# EAGLE design Tasmodul_RasPi_LoRa (EAGLE 9.6.2)
Assembly variants: STANDARD
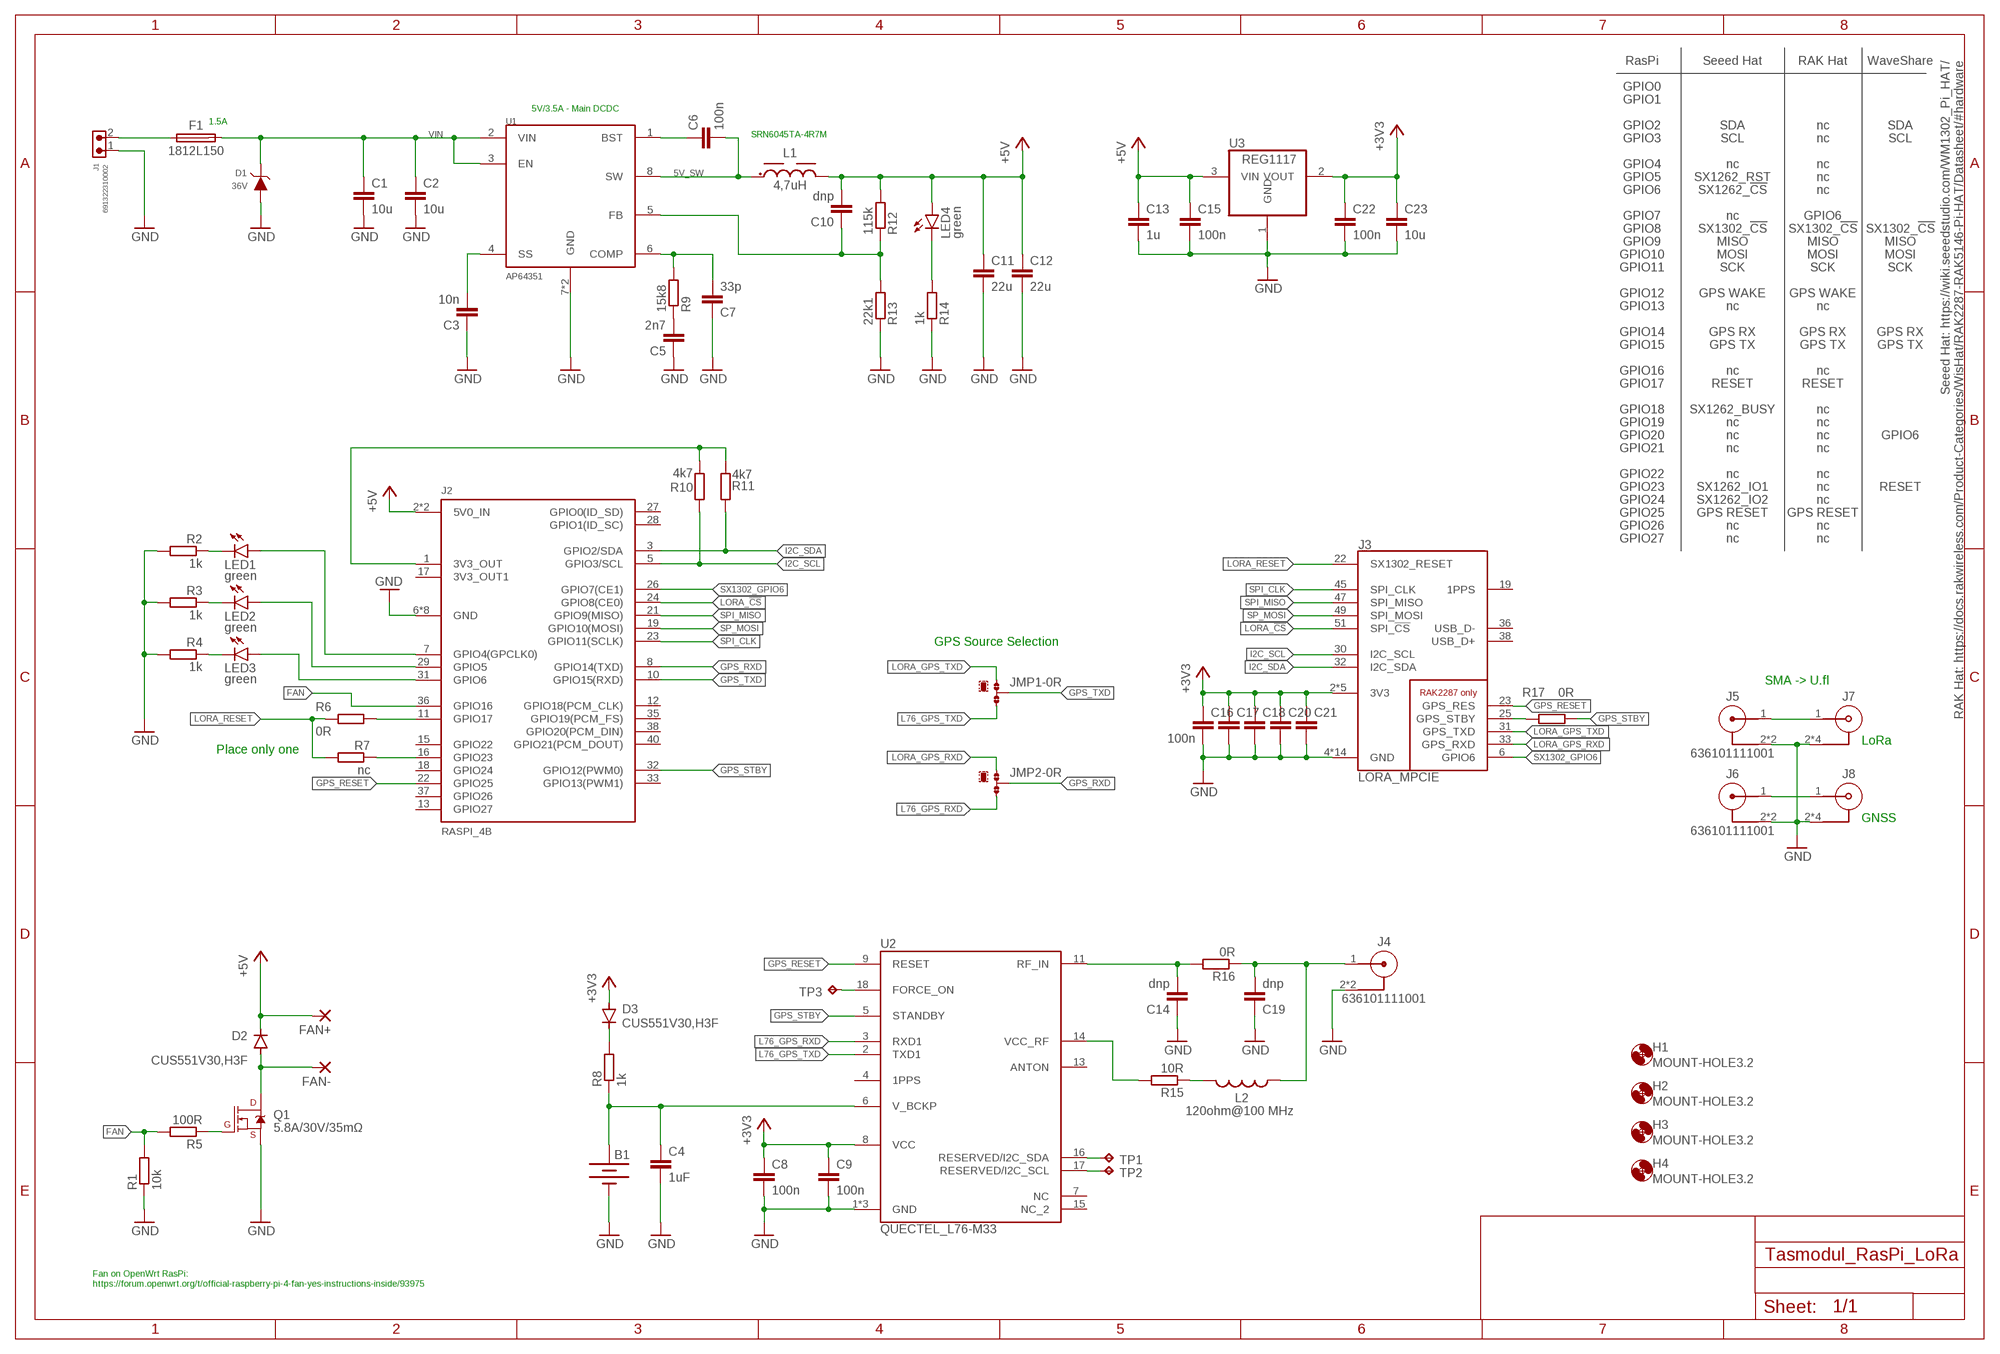
[diagram p0: schematic, sheet 1]

## Parts
B1  6.8MM_COIN_CELL  ML414H_IV01E_BATTERY  [ML414H_IV01E]
C1  10u  C-EUC1206  [C1206]
C2  10u  C-EUC1206  [C1206]
C3  10n  C-EUC0603  [C0603]
C4  1uF  C-EUC0603  [C0603]
C5  2n7  C-EUC0603  [C0603]
C6  100n  C-EUC0603  [C0603]
C7  33p  C-EUC0603  [C0603]
C8  100n  C-EUC0603  [C0603]
C9  100n  C-EUC0603  [C0603]
C10  dnp  C-EUC0603  [C0603]
C11  22u  C-EUC0805  [C0805]
C12  22u  C-EUC0805  [C0805]
C13  1u  C-EUC0603  [C0603]
C14  dnp  C-EUC0603  [C0603]  (not fitted in variant STANDARD)
C15  100n  C-EUC0603  [C0603]
C16  100n  C-EUC0603  [C0603]
C17  100n  C-EUC0603  [C0603]
C18  100n  C-EUC0603  [C0603]
C19  dnp  C-EUC0603  [C0603]  (not fitted in variant STANDARD)
C20  100n  C-EUC0603  [C0603]
C21  100n  C-EUC0603  [C0603]
C22  100n  C-EUC0603  [C0603]
C23  10u  C-EUC0603  [C0603]
D1  36V  WE-TVSP_DO-214AC_400W_UNI_824500361  [WE-TVSP_DO-214AC_UNIDIRECTIONAL]
D2  CUS551V30,H3F  DIODE-SOD323-R  [SOD323-R]
D3  CUS551V30,H3F  DIODE-SOD323-R  [SOD323-R]
F1  1812L150  [FUSC4532X125]
FAN+  1,6/0,8  [1,6/0,8]
FAN-  1,6/0,8  [1,6/0,8]
H1  MOUNT-HOLE3.2  [3,2]  (not fitted in variant STANDARD)
H2  MOUNT-HOLE3.2  [3,2]  (not fitted in variant STANDARD)
H3  MOUNT-HOLE3.2  [3,2]  (not fitted in variant STANDARD)
H4  MOUNT-HOLE3.2  [3,2]  (not fitted in variant STANDARD)
J1  691322310002  691322310002  [691322310002]
J2  RASPI_4B  [RASPI_4B_FLIPPED_SMD]
J3  LORA_MPCIE  [MINI_PCIE_CONNECTOR_5.2H]
J4  636101111001  [636101111001]
J5  636101111001  [636101111001]  (not fitted in variant STANDARD)
J6  636101111001  [636101111001]  (not fitted in variant STANDARD)
J7  60311002111526  [60311002111526]
J8  60311002111526  [60311002111526]
JMP1  0R-JUMPA  [A0R-JMP]
JMP2  0R-JUMPA  [A0R-JMP]
L1  4,7uH  WE-LQS_6045_74404064033  [WE-LQS_6045]
L2  120ohm@100 MHz  WE-CBF_0603_74279262_WB_HS  [WE-CBF_0603_W2.2]
LED1  green  LEDCHIPLED_0603  [CHIPLED_0603]
LED2  green  LEDCHIPLED_0603  [CHIPLED_0603]
LED3  green  LEDCHIPLED_0603  [CHIPLED_0603]
LED4  green  LEDCHIPLED_0603  [CHIPLED_0603]
Q1  5.8A/30V/35mΩ  MOSFET-NCH-AO3404A  [SOT23-3]
R1  10k  R-EU_R0603  [R0603]
R2  1k  R-EU_R0603  [R0603]
R3  1k  R-EU_R0603  [R0603]
R4  1k  R-EU_R0603  [R0603]
R5  100R  R-EU_R0603  [R0603]
R6  0R  R-EU_R0603  [R0603]
R7  nc  R-EU_R0603  [R0603]  (not fitted in variant STANDARD)
R8  1k  R-EU_R0603  [R0603]
R9  15k8  R-EU_R0603  [R0603]
R10  4k7  R-EU_R0603  [R0603]
R11  4k7  R-EU_R0603  [R0603]
R12  115k  R-EU_R0603  [R0603]
R13  22k1  R-EU_R0603  [R0603]
R14  1k  R-EU_R0603  [R0603]
R15  10R  R-EU_R0603  [R0603]
R16  0R  R-EU_R0603  [R0603]
R17  0R  R-EU_R0603  [R0603]
TP1  TPTP15R  [TP15R]  (not fitted in variant STANDARD)
TP2  TPTP15R  [TP15R]  (not fitted in variant STANDARD)
TP3  TPTP15R  [TP15R]  (not fitted in variant STANDARD)
U1  AP64351  [SOIC8-EP]
U2  QUECTEL_L76-M33  [L76_QWS]
U3  REG1117  [SOT223]

## Nets
5V_SW: C6.2 L1.1 U1.8(SW)
+3V3: C8.1 C9.1 C16.1 C17.1 C18.1 C20.1 C21.1 C22.1 C23.1 D3.A J3.2(3V3) J3.24(3V3) J3.39(3V3) J3.41(3V3) J3.52(3V3) U2.8(VCC) U3.2(VOUT)
+5V: C10.2 C11.1 C12.1 C13.1 C15.1 D2.C FAN+.1(P) J2.2(5V0_IN) J2.4(5V0_IN) L1.2 LED4.A R12.2 U3.3(VIN)
FAN: J2.36(GPIO16) R1.2 R5.2
GND: B1.- C1.2 C2.2 C3.1 C4.2 C5.1 C7.1 C8.2 C9.2 C11.2 C12.2 C13.2 C14.1 C15.2 C16.2 C17.2 C18.2 C19.1 C20.2 C21.2 C22.2 C23.2 D1.2(A) J1.1 J2.6(GND) J2.9(GND) J2.14(GND) J2.20(GND) J2.25(GND) J2.30(GND) J2.34(GND) J2.39(GND) J3.4(GND) J3.9(GND) J3.15(GND) J3.18(GND) J3.21(GND) J3.26(GND) J3.27(GND) J3.29(GND) J3.34(GND) J3.35(GND) J3.37(GND) J3.40(GND) J3.43(GND) J3.50(GND) J4.2 J4.3 J5.2 J5.3 J6.2 J6.3 J7.2 J7.3 J7.4 J7.5 J8.2 J8.3 J8.4 J8.5 Q1.2(S) R1.1 R2.2 R3.2 R4.2 R13.1 R14.1 U1.7(GND) U1.9(GND) U2.1(GND) U2.10(GND) U2.12(GND) U3.1(GND)
GPS_RESET: J2.22(GPIO25) J3.23(GPS_RES) U2.9(RESET)
GPS_RXD: J2.8(GPIO14(TXD)) JMP2.2
GPS_STBY: J2.32(GPIO12(PWM0)) R17.1 U2.5(STANDBY)
GPS_TXD: J2.10(GPIO15(RXD)) JMP1.2
HF_GNSS [50R]: J6.1 J8.1
HF_LORA [50R]: J5.1 J7.1
I2C_SCL: J2.5(GPIO3/SCL) J3.30(I2C_SCL) R10.1
I2C_SDA: J2.3(GPIO2/SDA) J3.32(I2C_SDA) R11.1
L76_GPS_RXD: JMP2.3 U2.3(RXD1)
L76_GPS_TXD: JMP1.3 U2.2(TXD1)
LORA_!CS: J2.24(GPIO8(CE0)) J3.51(SPI_!CS)
LORA_GPS_RXD: J3.33(GPS_RXD) JMP2.1
LORA_GPS_TXD: J3.31(GPS_TXD) JMP1.1
LORA_RESET: J3.22(SX1302_RESET) R6.2 R7.2
N$1: J2.16(GPIO23) R7.1
N$2: C3.2 U1.4(SS)
N$3: J2.11(GPIO17) R6.1
N$4: L2.2 R15.1
N$5: C6.1 U1.1(BST)
N$6: C10.1 R12.1 R13.2 U1.5(FB)
N$7: LED4.C R14.2
N$8: D3.C R8.2
N$9: Q1.1(G) R5.1
N$10: R15.2 U2.14(VCC_RF)
N$11: C5.2 R9.1
N$12: C7.2 R9.2 U1.6(COMP)
N$13: J2.1(3V3_OUT) R10.2 R11.2
N$14: D2.A FAN-.1(P) Q1.3(D)
N$15: F1.1 J1.2
N$16: TP1.TP U2.16(RESERVED/I2C_SDA)
N$17: TP2.TP U2.17(RESERVED/I2C_SCL)
N$18: TP3.TP U2.18(FORCE_ON)
N$19: J3.25(GPS_STBY) R17.2
N$20: LED1.C R2.1
N$21: LED2.C R3.1
N$22: LED3.C R4.1
N$23: J2.7(GPIO4(GPCLK0)) LED1.A
N$24: J2.29(GPIO5) LED2.A
N$25: J2.31(GPIO6) LED3.A
RF_CON [50R]: C19.2 J4.1 L2.1 R16.1
RF_MATCHED [50R]: C14.2 R16.2 U2.11(RF_IN)
SP_MOSI: J2.19(GPIO10(MOSI)) J3.49(SPI_MOSI)
SPI_CLK: J2.23(GPIO11(SCLK)) J3.45(SPI_CLK)
SPI_MISO: J2.21(GPIO9(MISO)) J3.47(SPI_MISO)
SX1302_GPIO6: J2.26(GPIO7(CE1)) J3.6(GPIO6)
VBAT: B1.+ C4.1 R8.1 U2.6(V_BCKP)
VIN: C1.1 C2.1 D1.1(C) F1.2 U1.2(VIN) U1.3(EN)
Unconnected: J2.12(GPIO18(PCM_CLK)) J2.13(GPIO27) J2.15(GPIO22) J2.17(3V3_OUT1) J2.18(GPIO24) J2.27(GPIO0(ID_SD)) J2.28(GPIO1(ID_SC)) J2.33(GPIO13(PWM1)) J2.35(GPIO19(PCM_FS)) J2.37(GPIO26) J2.38(GPIO20(PCM_DIN)) J2.40(GPIO21(PCM_DOUT)) J3.19(1PPS) J3.36(USB_D-) J3.38(USB_D+) U2.4(1PPS) U2.7(NC) U2.13(ANTON) U2.15(NC_2)

## Notes on the sheet
- RasPi | Seeed Hat | RAK Hat | WaveShare
- Seeed Hat: https://wiki.seeedstudio.com/WM1302_Pi_HAT/
  RAK Hat: https://docs.rakwireless.com/Product-Categories/WisHat/RAK2287-RAK5146-Pi-HAT/Datasheet/#hardware
- GPIO0
- GPIO1
- 5V/3.5A - Main DCDC
- 1.5A | GPIO2 | SDA | nc | SDA
- SRN6045TA-4R7M | GPIO3 | SCL | nc | SCL
- GPIO4 | nc | nc
- GPIO5 | SX1262_RST | nc
- GPIO6 | SX1262_!CS | nc
- GPIO7 | nc | GPIO6
- GPIO8 | SX1302_!CS | SX1302_!CS | SX1302_!CS
- GPIO9 | MISO | MISO | MISO
- GPIO10 | MOSI | MOSI | MOSI
- GPIO11 | SCK | SCK | SCK
- GPIO12 | GPS WAKE | GPS WAKE
- GPIO13 | nc | nc
- GPIO14 | GPS RX | GPS RX | GPS RX
- GPIO15 | GPS TX | GPS TX | GPS TX
- GPIO16 | nc | nc
- GPIO17 | RESET | RESET
- GPIO18 | SX1262_BUSY | nc
- GPIO19 | nc | nc
- GPIO20 | nc | nc | GPIO6
- GPIO21 | nc | nc
- GPIO22 | nc | nc
- GPIO23 | SX1262_IO1 | nc | RESET
- GPIO24 | SX1262_IO2 | nc
- GPIO25 | GPS RESET | GPS RESET
- GPIO26 | nc | nc
- GPIO27 | nc | nc
- GPS Source Selection
- SMA -> U.fl
- Place only one | LoRa
- GNSS
- Fan on OpenWrt RasPi:
  https://forum.openwrt.org/t/official-raspberry-pi-4-fan-yes-instructions-inside/93975

## Library data of the parts
B1 = SparkFun-Batteries:ML414H_IV01E_BATTERY: SEIKO ML414H-IV01E Reflowable Lithium Battery ML414H is a rechargeable, coin type battery with features such as Pb-free reflowable (Peak temperature: 260 C) and high temperature heat resistance. Battery Characteristics: 3.1V max voltage Voff is 2V 1mAH 3k series resistor with battery 72 hour charge time from 2.0-3.1V 2.3-2.8V initial charge; PROD_ID: BATT-14267
C1-C23 = rcl:C-EU: CAPACITOR, European symbol; SPICEPREFIX: C
D1 = Wurth_EMC Components_WE-TVSP:WE-TVSP_DO-214AC_400W_UNI: WE-TVSP Power TVS Diode Characteristics Low Profile Package Glass passivated Juction Excellent clamping capability Fast response time MSL Level 1, per J-STD-020 Classification of the plastic case: UL 94 V-0 Safety certification UL 497B, E478010 Identical design: - DO-214AC = SMAJ - DO-214AA = SMBJ - DO-214AB = SMCJ/SMDJ Applications Ideal to protect the I/O Interfaces, Bus Voltage and other circuits of sensetive electronic equipment against voltage transiensts <https://www.we-online.com/catalog/media/o55793v209%20WE-TVSP_600W-3000W_D0214AA_4C.jpg> Details see: https://www.we-online.com/catalog/en/WE-TVSP/ Updated by Ella Wu 2020-07-20 2020 (C) Würth Elektronik; DATASHEET-URL: https://www.we-online.com/catalog/datasheet/824500361.pdf; IPEAK: 6.9A; MOUNT: SMT; PART-NUMBER: 824500361; PDISS: 400W; VBR: 42.1V; VCLAMP: 58.1V
D2 D3 = diode:DIODE-: DIODE
F1 = Fuse:1812L: 1812L Series PTC provides surface mount overcurrent protection for applications where resettable protection is desired. Datasheet <https://www.littelfuse.com/~/media/electronics/datasheets/resettable_ptcs/littelfuse_ptc_1812l_datasheet.pdf.pdf>; CATEGORY: FUSE; DESCRIPTION: Resettable PTCs; MANUFACTURER: Littlefuse; MPN: 1812L150; OPERATING_TEMPERATURE: -40°C to +85°C; PART_STATUS: ACTIVE; ROHS_COMPLIANCE: RoHS Compliant; SERIES: 1812L; SUBCATEGORY: Resettable; TYPE: PTC
FAN+ FAN- = wirepad:1,6/0,8: THROUGH-HOLE PAD
H1-H4 = holes:MOUNT-HOLE: MOUNTING HOLE with drill center marker
J1 = Wurth_Connectors_WR-TBL Pluggable Connector:691322310002: WR-TBL Serie 322 - 3.81 mm Horizontal PCB Header KIND PROPERTIES Pitch 3.81 mm MATERIAL PROPERTIES Insulator Material PA66 Insulator Flammability Rating UL94 V-0 Contact Material Brass Contact Plating Tin GENERAL INFORMATION Operating Temperature -40 up to +105 °C Compliance RoHS ELECTRICAL PROPERTIES IR cULus 10 A IR VDE 10.5 A Working Voltage [cULus] 300 V (AC) Working Voltage [VDE] 300 V (AC) Withstanding Voltage [cULus] 1600 V (AC) Withstanding Voltage [VDE] 2500 V (AC) Contact Resistance [cULus] 20 mΩ Contact Resistance [VDE] 20 mΩ CERTIFICATION cULus Approval E315414 VDE Approval 40023195 <https://www.we-online.com/catalog/media/o33277v209%20Family_WR-TBL_6913223100xx.jpg> Details see: https://www.we-online.com/catalog/en/TBL_3_81_322_HORIZONTAL_PCB_HEADER_6913223100XX/ Updated by Ella Wu 2022-07-25 2022(C) Wurth Elektronik; DATASHEET-URL: https://www.we-online.com/redexpert/spec/691322310002?ae; IR-UL: 10A; IR-VDE: 10.5A; MOUNT: THT; PART-NUMBER: 691322310002; PINS: 2; PITCH: 3.81mm; TYPE: Horizontal; WORKING-VOLTAGE-UL: 300V (AC); WORKING-VOLTAGE-VDE: 300V (AC)
J2 = Eigene-Rietig:RASPI_4B
J3 = Eigene-Rietig:LORA_MPCIE: Seeed Studio WM1302 RAK Wireless RAK2287
J4-J6 = Wurth_Connectors_WR-UMRF:636101111001: WR-UMRF PCB Receptacle SMT with 3 Pads MATERIAL PROPERTIES Insulator Material LCP Insulator Color Natural Insulator Flammability Rating UL94 V-0 Center Contact Material Brass Center Contact Plating Gold over Nickel GENERAL INFORMATION Operating Temperature -40 up to +90 °C Electrical Properties f DC~6 GHz <https://www.we-online.com/components/media/o325314v209%20Single_WR-UMRF_63610111x001.jpg> Details see: www.we-online.com/components/products/PCB_RECECTACLE_SMT_WITH_3_PADS <www.we-online.com/catalog/PCB_RECECTACLE_SMT_WITH_3_PADS/?utm_source=eagle_model&utm_medium=description_link&utm_campaign=eisos_eagle> Updated by Ella Wu 2023-06-16 2023(C) Würth Elektronik; DATASHEET-URL: https://www.we-online.com/redexpert/spec/636101111001?ae; GENDER: PCB Receptacle; MOUNT: SMT; PART-NUMBER: 636101111001; Z: 50Ohm
J7 J8 = Wurth_Connectors_WR-SMA:60311002111526: WR-SMA PCB THT/THR/SMT Characteristics Interface: MIL-STD-348 Mating Cycle: 500 Cycles Impedance: 50Ω Insulation Resistance: 5000MΩ(min.) Withstanding Voltage: 1000Vrms(min.) Ingress Protection: None l IP67 Mating: Screw (Recommended by torque wrench tool) Applications Network and communications RF Test and measurement equipment Industrial applications Electronic consumers and device Outdoor or humidity environment <https://www.we-online.com/components/media/o176646v209%20Family-WR-SMA%20Cable%20Connectors.jpg> Details see: www.we-online.com/components/products/COAX_SMA_CONNECTOR_PCB_THT_THR_SMT <www.we-online.com/catalog/COAX_SMA_CONNECTOR_PCB_THT_THR_SMT/?utm_source=eagle_model&utm_medium=description_link&utm_campaign=eisos_eagle> Updated by Ella Wu 2023-10-10 2023(C) Würth Elektronik; DATASHEET-URL: https://www.we-online.com/redexpert/spec/60311002111526?ae; FREQUENCY-RANGE: DC~6 GHz; IMPEDANCE: 50Ohm; INTERFACE: MIL-STD-348; MOUNT: THT; PART-NUMBER: 60311002111526; SIZE: Right Angle Jack
JMP1 JMP2 = jump-0r-smd:0R-JUMP: SMD 0R 0805 Jumper
L1 = Wurth_Power Magnetics_WE-LQS:WE-LQS_6045: WE-LQS SMD Power Inductor Semi Shielded Characteristics Compact design Power Inductor 1.7 times more current than compared to an unshielded version Robust construction Low RDC Magnetically shielded by use of a magnetic resin Operating temperature: -40°C to +125°C Applications Integrated DC/DC Converters Switching controllers which require high efficiency Portable power (PDA, Smartphones, Digital Cameras, TVs, LCD etc.) Embedded Laptops and PCs Big sizes can be used in shock resisting circuits <https://www.we-online.com/catalog/media/o14807v209%20Family_WE-LQS.jpg> Details see: www.we-online.com/catalog/WE-LQS <www.we-online.com/catalog/WE-LQS/?utm_source=eagle_model&utm_medium=description_link&utm_campaign=eisos_eagle> Updated by Ella Wu 2022-07-21 2022 (C) Wurth Elektronik; DATASHEET-URL: https://www.we-online.com/redexpert/spec/74404064033?ae; FRES: 42MHz; IR: 4.2A; ISAT: 6.5A; PART-NUMBER: 74404064033; RDC: 21mOhm; VALUE: 3.3uH
L2 = Wurth_EMC Components_WE-CBF:WE-CBF_0603: WE-CBF SMD EMI Suppression Ferrite Bead Characteristics Reliable Ni-Sn electrodes High rated current up to 10 A AEC-Q200 qualified Operating temperature: –55 ºC to +125 ºC Applications Perfect as data line filter and for uncoupling of distribution voltage <https://www.we-online.com/components/media/o14753v209%20Family_WE-CBF.jpg> Details see: www.we-online.com/en/components/products/WE-CBF <www.we-online.com/catalog/WE-CBF/?utm_source=eagle_model&utm_medium=description_link&utm_campaign=eisos_eagle> Updated by Ella Wu 2024-01-29 2024(C) Wurth Elektronik; DATASHEET-URL: https://www.we-online.com/redexpert/spec/74279262?ae; FI: 0.3mm; HEIGHT: 0.8mm; IR2: 1350mA; LENGTH: 1.6mm; MOUNT: SMT; PART-NUMBER: 74279262; RDC-MAX: 0.3ohm; SIZE: 0603; TYPE: Wide Band; WIDTH: 0.8mm; Z-MAX: 200ohm@510 MHz
LED1-LED4 = led:LED: LED OSRAM: - CHIPLED LG R971, LG N971, LY N971, LG Q971, LY Q971, LO R971, LY R971 LH N974, LH R974 LS Q976, LO Q976, LY Q976 LO Q996 - Hyper CHIPLED LW Q18S LB Q993, LB Q99A, LB R99A - SideLED LS A670, LO A670, LY A670, LG A670, LP A670 LB A673, LV A673, LT A673, LW A673 LH A674 LY A675 LS A676, LA A676, LO A676, LY A676, LW A676 LS A679, LY A679, LG A679 - Hyper Micro SIDELED® LS Y876, LA Y876, LO Y876, LY Y876 LT Y87S - SmartLED LW L88C, LW L88S LB L89C, LB L89S, LG L890 LS L89K, LO L89K, LY L89K LS L896, LA L896, LO L896, LY L896 - TOPLED LS T670, LO T670, LY T670, LG T670, LP T670 LSG T670, LSP T670, LSY T670, LOP T670, LYG T670 LG T671, LOG T671, LSG T671 LB T673, LV T673, LT T673, LW T673 LH T674 LS T676, LA T676, LO T676, LY T676, LB T676, LH T676, LSB T676, LW T676 LB T67C, LV T67C, LT T67C, LS T67K, LO T67K, LY T67K, LW E67C LS E67B, LA E67B, LO E67B, LY E67B, LB E67C, LV E67C, LT E67C LW T67C LS T679, LY T679, LG T679 LS T770, LO T770, LY T770, LG T770, LP T770 LB T773, LV T773, LT T773, LW T773 LH T774 LS E675, LA E675, LY E675, LS T675 LS T776, LA T776, LO T776, LY T776, LB T776 LHGB T686 LT T68C, LB T68C - Hyper Mini TOPLED® LB M676 - Mini TOPLED Santana® LG M470 LS M47K, LO M47K, LY M47K Source: http://www.osram.convergy.de LUXEON: - LUMILED® LXK2-PW12-R00, LXK2-PW12-S00, LXK2-PW14-U00, LXK2-PW14-V00 LXK2-PM12-R00, LXK2-PM12-S00, LXK2-PM14-U00 LXK2-PE12-Q00, LXK2-PE12-R00, LXK2-PE12-S00, LXK2-PE14-T00, LXK2-PE14-U00 LXK2-PB12-K00, LXK2-PB12-L00, LXK2-PB12-M00, LXK2-PB14-N00, LXK2-PB14-P00, LXK2-PB14-Q00 LXK2-PR12-L00, LXK2-PR12-M00, LXK2-PR14-Q00, LXK2-PR14-R00 LXK2-PD12-Q00, LXK2-PD12-R00, LXK2-PD12-S00 LXK2-PH12-R00, LXK2-PH12-S00 LXK2-PL12-P00, LXK2-PL12-Q00, LXK2-PL12-R00 Source: www.luxeon.com KINGBRIGHT: KA-3528ASYC Source: www.kingbright.com
Q1 = SparkFun-DiscreteSemi:MOSFET-NCH: N-channel MOSFETs Voltage controlled devices that allow control of high current outputs. SparkFun Products: SparkFun OpenScale <https://www.sparkfun.com/products/13261> SparkFun Digital Sandbox <https://www.sparkfun.com/products/12651> SparkFun Monster Moto Shield <https://www.sparkfun.com/products/10182> SparkFun MOSFET Power Controller <https://www.sparkfun.com/products/11214>; PROD_ID: TRANS-12988
R1-R17 = rcl:R-EU_: RESISTOR, European symbol; SPICEPREFIX: R
TP1-TP3 = testpad:TP: Test pad
U1 = Eigene-Rietig:AP64351
U2 = Eigene-Rietig:QUECTEL_L76-M33
U3 = burr-brown:REG1117: 800mA and 1A Low Dropout (LDO) Positive Regulator 1.8V, 2.5V, 2.85V, 3.3V, 5V, and Adj; MPN: REG1117

## Net classes
1 50R: clearance 0.5 mm

## Board
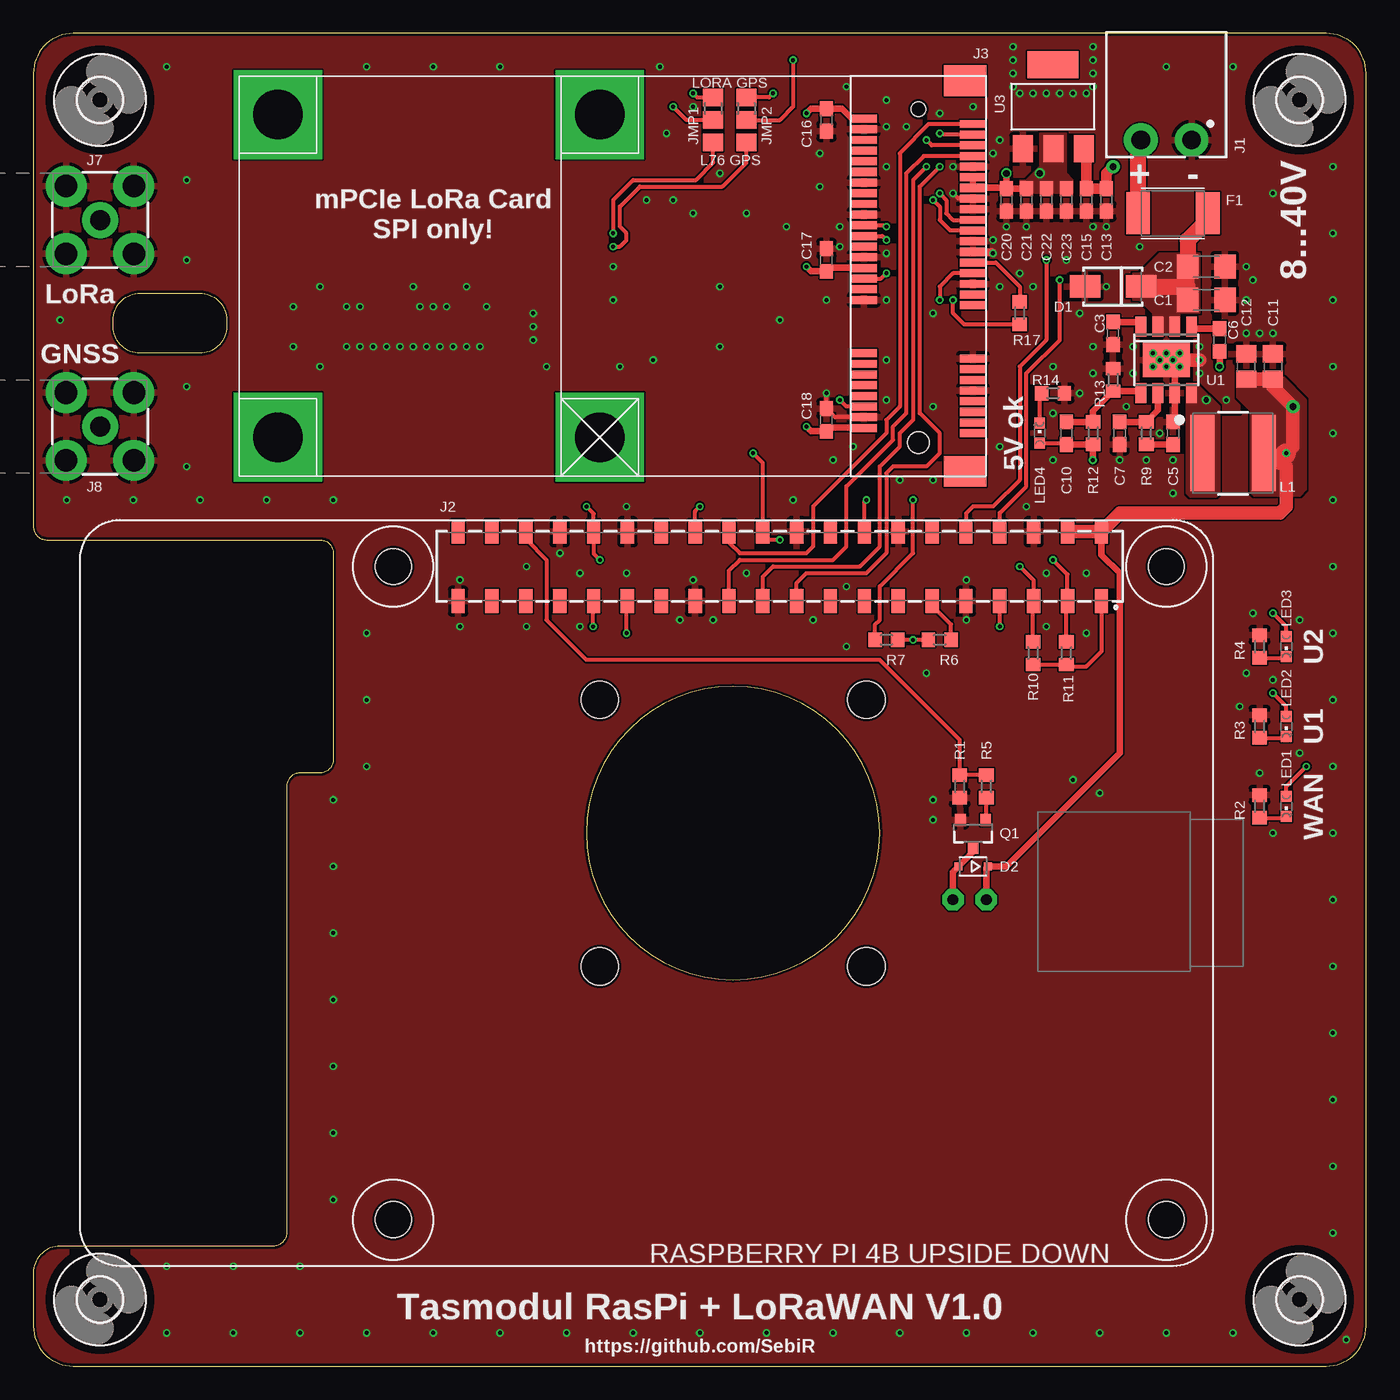
[diagram p1: board, top side]
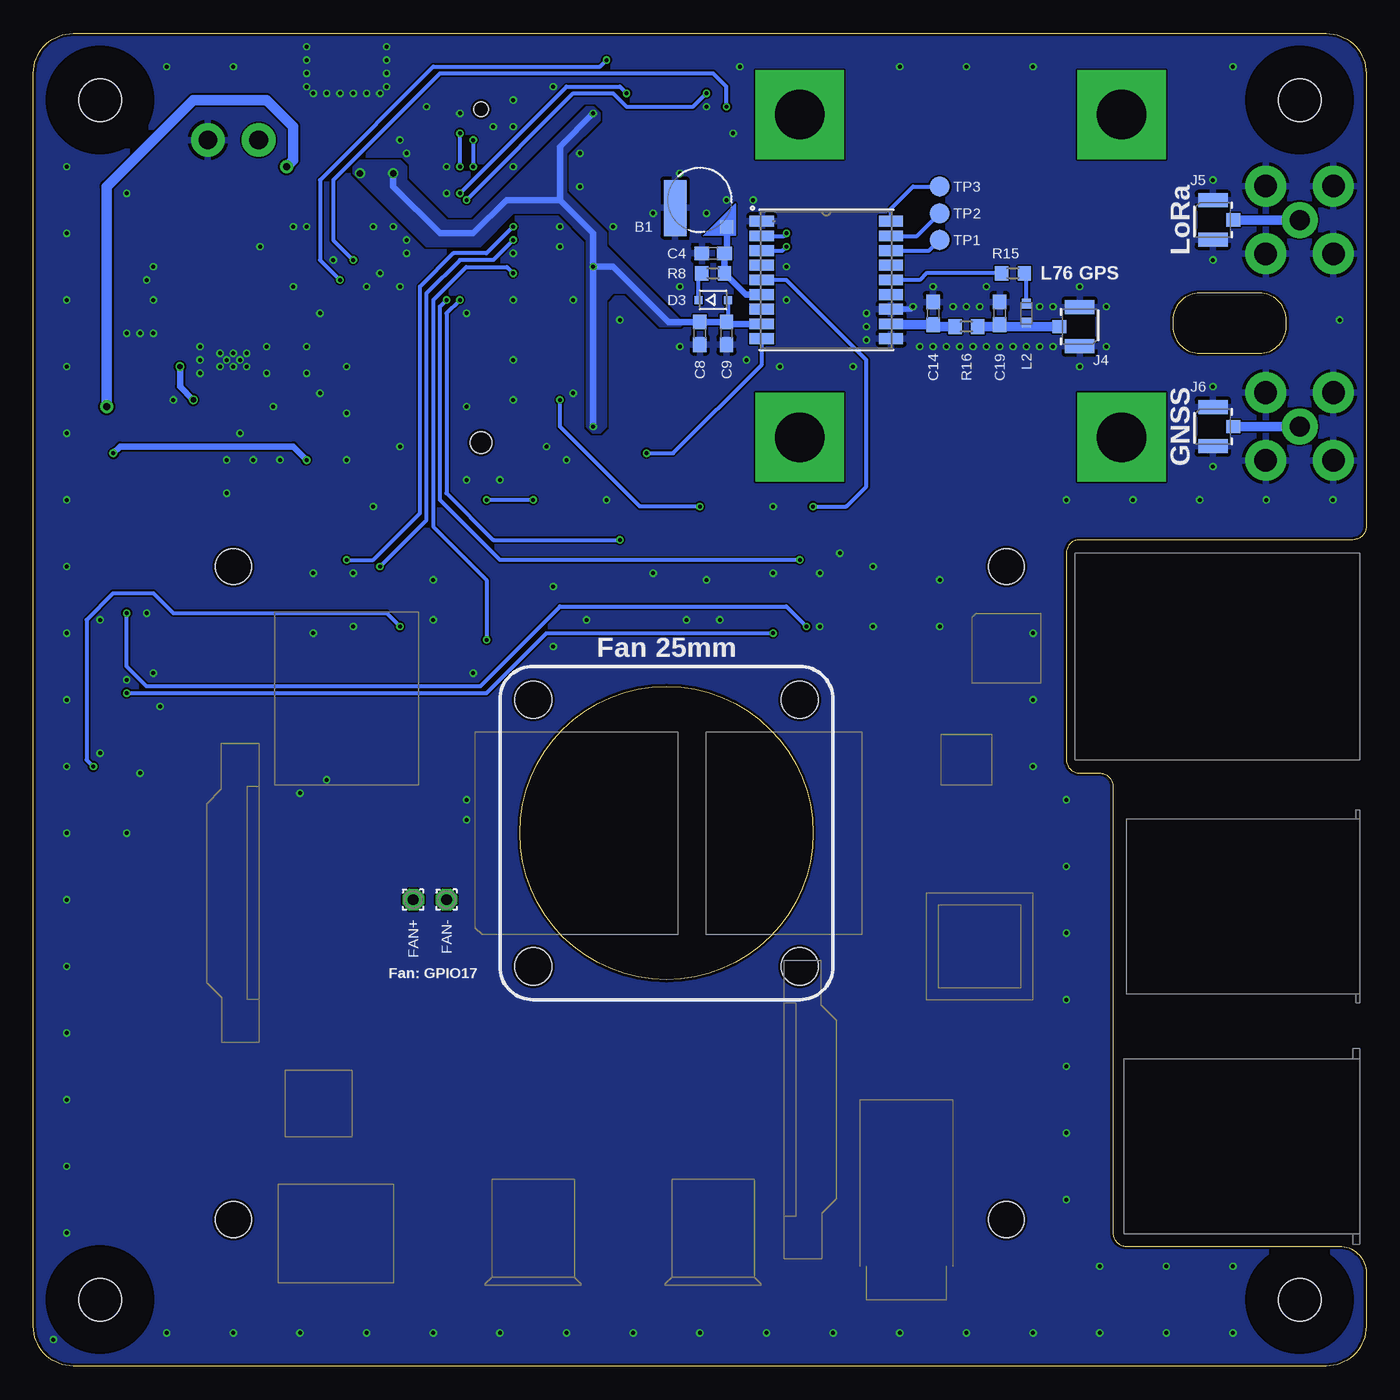
[diagram p2: board, bottom side, seen from below]

Size 100 x 100 mm. Coordinates in mm from the lower left corner, seen from the top.
Outline: 0,97 0,63 arc90 1,62 21.5,62 arc-90 22.5,61 22.5,45.5 arc-90 21.5,44.5 20,44.5 arc90 19,43.5 19,10 arc-90 18,9 2,9 arc90 0,7 0,3 arc90 3,0 97,0 arc90 100,3 100,97 arc90 97,100 3,100 arc90 0,97
Outline: 12.5,76 8,76 arc-90 6,78 6,78.5 arc-90 8,80.5 12.5,80.5 arc-90 14.5,78.5 14.5,78 arc-90 12.5,76
Copper layers (1*16): Top 0.035mm / dielectric 1.6mm / Bottom 0.035mm
Design rules "jlcpcb-2layers": minimum track width 0.2mm, minimum drill 0.3mm, track to track 5mil, track to pad 5mil, pad to pad 5mil, via to via 5mil, smd to smd 5mil, copper to edge 0.2mm, drill to drill 6mil, minimum pad ring 10mil, minimum via ring 0.125mm, stop-mask expansion 4mil, vias tented up to drill 0.5mm, thermal gap 10mil
tRestrict: 1 lines

### Footprints (pad centres in the part's own frame; a part is rotated, then mirrored left to right if it is on the bottom)
ML414H_IV01E = smd 1 x 1: + 2.022,2.032 | smd 4.2 x 1.7: - 0.6,-1.85
C1206 = smd 1.6 x 1.8: 1 -1.4,0; 2 1.4,0
C0603 = smd 1.1 x 1: 1 -0.85,0; 2 0.85,0
C0805 = smd 1.3 x 1.5: 1 -0.95,0; 2 0.95,0
WE-TVSP_DO-214AC_UNIDIRECTIONAL = smd 2.3 x 1.7: 1 -2.1,0; 2 2.1,0
SOD323-R = smd 0.6 x 0.6: A 1.1,0; C -1.1,0
FUSC4532X125 = smd 1.78 x 3.15: 1 -2.615,0; 2 2.615,0
1,6/0,8 = drill 0.813 pad 1.6 octagon: 1 0,0
3,2 = hole 3.2: 0,0
691322310002 = drill 1.4: 1 -1.905,0; 2 1.905,0
RASPI_4B_FLIPPED_SMD = smd 1 x 1.8: 1 76.632,49.902; 2 76.632,55.102; 3 74.092,49.902; 4 74.092,55.102; 5 71.552,49.902; 6 71.552,55.102; 7 69.012,49.902; 8 69.012,55.102; 9 66.472,49.902; 10 66.472,55.102; 11 63.932,49.902; 12 63.932,55.102; 13 61.392,49.902; 14 61.392,55.102; 15 58.852,49.902; 16 58.852,55.102; 17 56.312,49.902; 18 56.312,55.102; 19 53.772,49.902; 20 53.772,55.102; 21 51.232,49.902; 22 51.232,55.102; 23 48.692,49.902; 24 48.692,55.102; 25 46.152,49.902; 26 46.152,55.102; 27 43.612,49.902; 28 43.612,55.102; 29 41.072,49.902; 30 41.072,55.102; 31 38.532,49.902; 32 38.532,55.102; 33 35.992,49.902; 34 35.992,55.102; 35 33.452,49.902; 36 33.452,55.102; 37 30.912,49.902; 38 30.912,55.102; 39 28.372,49.902; 40 28.372,55.102 | hole 2.7: 81.5,52.5; 23.5,52.5; 23.5,3.5; 81.5,3.5
MINI_PCIE_CONNECTOR_5.2H = smd 0.6 x 2: 1 0,0; 2 0.4,8.2; 3 0.8,0; 4 1.2,8.2; 5 1.6,0; 6 2,8.2; 7 2.4,0; 8 2.8,8.2; 9 3.2,0; 10 3.6,8.2; 11 4,0; 12 4.4,8.2; 13 4.8,-0.005; 14 5.2,8.2; 15 5.6,0; 16 6,8.2; 17 9.6,0; 18 10,8.2; 19 10.4,0; 20 10.8,8.2; 21 11.2,0; 22 11.6,8.2; 23 12,-0.005; 24 12.4,8.2; 25 12.8,0; 26 13.2,8.2; 27 13.6,0; 28 14,8.2; 29 14.4,0; 30 14.8,8.2; 31 15.2,0; 32 15.6,8.2; 33 16,0; 34 16.4,8.2; 35 16.8,0; 36 17.2,8.2; 37 17.6,0; 38 18,8.2; 39 18.4,0; 40 18.8,8.2; 41 19.2,0; 42 19.6,8.2; 43 20,0; 44 20.4,8.2; 45 20.8,0; 46 21.2,8.2; 47 21.6,0; 48 22,8.2; 49 22.4,0; 50 22.8,8.2; 51 23.2,0; 52 23.6,8.2 | smd 2.3 x 3.2: 53 26.45,0.6; 55 -2.85,0.6 | drill 3.7 pad 5.8 square: M1 -0.3,28; M2 23.9,28; M3 -0.3,52.15; M4 23.9,52.15 | hole 1.6: -0.7,4.1 | hole 1.1: 24.3,4.1
636101111001 = smd 1 x 1.05: 1 0,-1.525 | smd 1.05 x 2.2: 2 1.475,0; 3 -1.475,0
60311002111526 = drill 1.5: 1 0,0 | drill 1.7: 2 -2.54,2.54; 3 2.54,2.54; 4 2.54,-2.54; 5 -2.54,-2.54
A0R-JMP = smd 1.5 x 1.3: 1 0,1.7; 2 0,0; 3 0,-1.7
WE-LQS_6045 = smd 1.8 x 5.7: 1 2.3,0; 2 -2.3,0
WE-CBF_0603_W2.2 = smd 0.75 x 0.7: 1 -0.725,0; 2 0.725,0
CHIPLED_0603 = smd 0.8 x 0.8: A 0,-0.75; C 0,0.75
SOT23-3 = smd 0.8 x 0.9: 1 -0.95,-1; 2 0.95,-1; 3 0,1.1
R0603 = smd 1 x 1.1: 1 -0.85,0; 2 0.85,0
TP15R = smd 1.5 x 1.5: TP 0,0
SOIC8-EP = smd 0.8 x 1.5: 1 -1.905,-2.5; 2 -0.635,-2.5; 3 0.635,-2.5; 4 1.905,-2.5; 5 1.905,2.5; 6 0.635,2.5; 7 -0.635,2.5; 8 -1.905,2.5 | smd 3.502 x 2.613: 9 0,0
L76_QWS = smd 1.803 x 0.813: 1 -4.85,4.4; 2 -4.85,3.3; 3 -4.85,2.2; 4 -4.85,1.1; 5 -4.85,0; 6 -4.85,-1.1; 7 -4.85,-2.2; 8 -4.85,-3.3; 9 -4.85,-4.4; 10 4.85,-4.4; 11 4.85,-3.3; 12 4.85,-2.2; 13 4.85,-1.1; 14 4.85,0; 15 4.85,1.1; 16 4.85,2.2; 17 4.85,3.3; 18 4.85,4.4
SOT223 = smd 1.499 x 2.007: 1 -2.261,-3.15; 2 0.025,-3.15; 3 2.311,-3.15 | smd 3.81 x 2.007: 4 0,3.15
FAN_25MM = hole 2.8: -10,10; 10,10; 10,-10; -10,-10

### Placement (x,y rotation side)
B1  50,87.5 270 bottom
C1  88,80 0 top
C2  88,82.5 0 top
C3  81,77.5 90 top
C4  49,83.5 180 bottom
C5  85.5,70 270 top
C6  89,77 270 top
C7  81.5,70 90 top
C8  50,77.5 270 bottom
C9  48,77.5 270 bottom
C10  77.5,70 270 top
C11  93,75 90 top
C12  91,75 90 top
C13  80.5,87.5 270 top
C14  32.5,79 270 bottom
C15  79,87.5 270 top
C16  59.5,93.5 270 top
C17  59.5,83 90 top
C18  59.5,71 90 top
C19  27.5,79 270 bottom
C20  73,87.5 270 top
C21  74.5,87.5 270 top
C22  76,87.5 270 top
C23  77.5,87.5 270 top
D1  81,81 180 top
D2  70.5,37.5 180 top
D3  49,80 0 bottom
F1  85.5,86.5 0 top
FAN+  71.5,35 0 bottom
FAN-  69,35 0 bottom
H1  5,5 0 top
H2  95,5 0 top
H3  95,95 0 top
H4  5,95 0 top
J1  85,92 180 top
J2  3.5,7.5 0 top
J3  70.5,70 90 top
J4  21.5,78 270 bottom
J5  11.5,86 90 bottom
J6  11.5,70.5 90 bottom
J7  5,86 180 top
J8  5,70.5 180 top
JMP1  51,93.5 0 top
JMP2  53.5,93.5 0 top
L1  90,68.5 180 top
L2  25.5,79 90 bottom
LED1  94,42 180 top
LED2  94,48 180 top
LED3  94,54 180 top
LED4  75.5,70 0 top
Q1  70.5,40 180 top
R1  69.5,43.5 90 top
R2  92,42 90 top
R3  92,48 90 top
R4  92,54 90 top
R5  71.5,43.5 90 top
R6  68,54.5 180 top
R7  64,54.5 0 top
R8  49,82 180 bottom
R9  83.5,70 90 top
R10  75,53.5 270 top
R11  77.5,53.5 270 top
R12  79.5,70 270 top
R13  81,74 270 top
R14  76.5,73 180 top
R15  26.5,82 180 bottom
R16  30,78 180 bottom
R17  74,79 90 top
TP1  32,84.5 0 bottom
TP2  32,86.5 0 bottom
TP3  32,88.5 0 bottom
U1  85,75.5 180 top
U2  40.5,81.5 0 bottom
U3  76.5,94.5 0 top
U$1  [FAN_25MM]  52.5,40 0 bottom

### Tracks (layer width: path | path; a pad name or v marks a point on that pad's centre or on a via)
5V_SW  (via drill 0.4)
  Top 0.5: C6.2 v89,75
  Bottom 0.5: v89,75 89,73.5 v88,72.5
  pour Top (no thermals): 86.5,73.7 86.5,65.5 86.8,65.2 88.7,65.2 89,65.5 89,72 87.3,73.7
+3V3  (via drill 0.3, 0.5)
  Top 0.5: v58,94 58.35,94.35 C16.1 60.65,94.35 61.4,93.6 J3.52 | v58,82.5 58.35,82.15 C17.1 59.75,82.4 J3.24 | v58,70.5 58.35,70.15 C18.1 59.75,70.4 J3.2 | C20.1 72.95,88.4 J3.39 J3.41 | C20.1 C21.1 | v73,89.5 C20.1
  Bottom 0.3: D3.A 47.9,78.45 C9.1
  Bottom 0.5: v58,94 60.5,91.5 60.5,87.5 | v58,82.5 58,85 60.5,87.5 | 60.5,87.5 64.5,87.5 67,85 69.5,85 73,88.5 v73,89.5 | v58,70.5 v58,82.5 | U2.8 47.85,78.2 C9.1 C8.1 52.35,78.35 56.5,82.5 v58,82.5
  other vias: 75.5,89.5
  pour Top (no thermals): 75.5,92.5 77.5,92.5 77.5,89.5 78,89 78,88 74,88 74,89 74.5,89 75.5,90
  pour Bottom: 72.5,90.5 75.5,90.5 76,90 76,89.5 70.5,84 66.5,84 64,86.5 60.5,86.5 58.5,84.5 58.5,70.5 58,70 57.5,70 57,70.5 57,76.5 57,76.5 57,80 56.5,80.5 55.5,80.5 53,78 51.5,78 51.25,78.25 57,84 57,85 60,88 60,91 57.5,93.5 57.5,94 58,94.5 58.5,94.5 67,86 69,86 72,89 72,90
+5V  (via drill 0.3 pad 0.6, 0.5 pad 1)
  Top 0.3: LED4.A 77.4,69.25 C10.2
  Top 0.5: v94,68.5 L1.2 | C10.2 R12.2 v79.5,68 | FAN+.1 71.5,37.4 D2.C 73,37.5 81.5,46 81.5,59.5 80.13,60.87 J2.2
  Top 0.8: U3.3 79,91.16 C15.1 C13.1 80.5,89.5 v81,90
  Top 1: J2.4 J2.2 81.53,64 93.5,64 94,64.5 94,67.5 93.5,68 | v94,68.5 94.5,69 v94.5,72 93,73.5 C11.1 C12.1
  Top 1.5: 93.5,68 v94,68.5
  Bottom 0.5: v79.5,68 80.5,69 93.5,69 v94,68.5
  Bottom 0.8: v81,90 80.5,90.5 80.5,93 82.5,95 88,95 94.5,88.5 v94.5,72
  pour Top (no thermals): 90.3,74.2 90.3,72.7 91.3,71.7 91.3,65.6 91.6,65.3 95,65.3 95.5,65.8 95.5,72.5 93.8,74.2
FAN
  Top 0.3: R5.2 R1.2 69.5,47 63.5,53 41.5,53 38.5,56 38.5,60.5 36.95,62.05 J2.36
GND  (via drill 0.3)
  Top 0.3: v59.5,73 C18.2 60.15,71.2 J3.4 | J3.37 69.4,87.6 v69,88
  Top 0.5: C5.1 85.64,70.98 U1.7 85.64,74.64 v86,75
  Top 0.6: J3.27 71.9,83.6 v72,83.5
  Top 1: U1.9 v87.5,75.5
  Bottom 0.4: U2.12 34.2,79.3 v34,79.5
  other vias: 86,76 84,76 84,75 85,75 85,76 82.5,76.5 82.5,74.5 82,72 85.5,75.5 84.5,75.5 91,82.5 91,80 93,77.5 91,77.5 87.5,76.5 87.5,74.5 84.5,70 81.5,68 83.5,68 85.5,68 79.5,76.5 79.5,74.5 78.5,79 77.5,83 80.5,81 74,95.5 75,95.5 76,95.5 77,95.5 78,95.5 79,95.5 79.5,96 79.5,97 79.5,98 79.5,99 73.5,96 73.5,97 73.5,98 73.5,99 69,90 64,90 64,95 64,83.5 64,80 74,82 72,84.5 64,93 59,91 60.5,84 73,85.5 74.5,85.5 72.5,81 32.5,81 28.5,81 29,79.5 30,79.5 31,79.5 24.5,79.5 23.5,79.5 21.5,81 19.5,79.5 19.5,76.5 21.5,75 23.5,76.5 24.5,76.5 25.5,76.5 26.5,76.5 27.5,76.5 28.5,76.5 29.5,76.5 30.5,76.5 31.5,76.5 32.5,76.5 33.5,76.5 37.5,77 37.5,78 37.5,79 72,91 44.5,64.5 49.5,59 70,59 39.5,61 32,59 48,87.5 53.5,86.5 49.5,86.5 70,56 58.5,56 10,2.5 98.5,2 15,2.5 20,2.5 25,2.5 30,2.5 35,2.5 40,2.5 45,2.5 50,2.5 55,2.5 60,2.5 65,2.5 70,2.5 75,2.5 80,2.5 85,2.5 90,2.5 97.5,10 97.5,15 97.5,20 97.5,25 97.5,30 97.5,35 97.5,40 97.5,45 97.5,50 97.5,55 97.5,60 97.5,65 97.5,70 97.5,75 97.5,80 97.5,85 97.5,90 90,97.5 85,97.5 10,97.5 25,97.5 30,97.5 35,97.5 47.5,92.5 10,7.5 15,7.5 20,7.5 22.5,12.5 22.5,17.5 22.5,22.5 22.5,27.5 22.5,32.5 22.5,37.5 22.5,42.5 25,45 25,50 25,55 2.5,65 7.5,65 12.5,65 17.5,65 22.5,65 57,65 60,68 61.5,69 65,66.5 67.5,66.5 61,58.5 11.5,73.5 11.5,67.5 11.5,89 11.5,83 2,78.5 68,94 65.5,93 67.5,72 72.5,69 75,81 64,72.5 56,78.5 56.5,85.5 60.5,85.5 49.5,94.5 61,96 51.5,89.5 43.5,80 38.5,75 44,75 46.5,75.5 51.5,76.5 51.5,81 59.5,80 41,55.5 37,60 53.5,59.5 74.5,64.5 85.5,65.5 89.5,72.5 92,77.5 91.5,81.5 83,84 93,88 76.5,68 76.5,71.5 76.5,75 64,75.5 67.5,79 61,54 41,59.5 67,52 76,55.5 78,44 80,43 67.5,42.5 67.5,41 92,44.5 91,52 93,51.5 90.5,49.5 91.5,56.5 95,56 95,46 93,40 48.5,56 51,56 37,55.5 46,87.5 43.5,82.5 79.5,85.5 80.5,85.5 47,97.5 78.5,73 32,55.5 44.5,59.5 59,88.5 79,55 79,59.5 76,59.5 72.5,92 70.5,94.5
  pour Top (rank 6): 0,100 100,100 100,0 0,0
  pour Bottom (rank 6): 0,100 100,100 100,0 0,0
GPS_RESET  (via drill 0.3)
  Top 0.3: v56,62 55,62 54.73,62.27 J2.22 54.73,67.77 v54,68.5 | J3.23 69,82 68,81 v68,80
  Bottom 0.3: v68,80 69,79 69,65.5 65.5,62 v56,62 | v54,68.5 52,68.5 45.35,75.15 U2.9
GPS_RXD  (via drill 0.3)
  Top 0.3: JMP2.2 56,93.5 57,94.5 v57,98 | J2.8 72.51,64.01 74.5,66 74.5,74.5 77,77 v77,81.5
  Bottom 0.3: v77,81.5 78.5,83 78.5,89 70,97.5 57.5,97.5 v57,98
GPS_STBY  (via drill 0.3)
  Top 0.3: v42.5,60.5 42.03,60.97 J2.32 42.03,63.97 v41.5,64.5 | R17.1 69.85,78.15 69,79 v69,80
  Bottom 0.3: v42.5,60.5 65,60.5 69.5,65 69.5,79.5 v69,80 | v41.5,64.5 39,64.5 37.5,66 37.5,75.5 43.5,81.5 U2.5
GPS_TXD  (via drill 0.3)
  Top 0.3: v76,83 76,77 74,75 74,66.5 72,64.5 70.5,64.5 69.97,63.97 J2.10 | JMP1.2 49,93.5 v48,94.5
  Bottom 0.3: v76,83 77.5,84.5 77.5,89 69.5,97 49,97 48,96 v48,94.5
HF_GNSS
  Bottom 0.7: J8.1 J6.1
HF_LORA
  Bottom 0.7: J7.1 J5.1
I2C_SCL  (via drill 0.3)
  Top 0.3: J3.30 63.7,84.8 v64,84.5 | J2.5 75.05,57.5 | 75.05,57.5 75.05,58.95 v74,60 | R10.1 75,57.45 75.05,57.5
  Bottom 0.3: v64,84.5 65.5,83 68,83 70.5,80.5 70.5,63.5 v74,60
I2C_SDA  (via drill 0.3)
  Top 0.3: J3.32 63.9,85.6 v64,85.5 | v76.5,60.5 77.59,59.41 J2.3 77.5,57.31 R11.1
  Bottom 0.3: v64,85.5 66,83.5 68.5,83.5 71,81 71,64 74.5,60.5 v76.5,60.5
L76_GPS_RXD  (via drill 0.3)
  Top 0.3: v43.5,84 44,84 44.5,84.5 44.5,85 44,85.5 44,87 45.5,88.5 51.7,88.5 53.5,90.3 JMP2.3
  Bottom 0.3: U2.3 43.8,83.7 v43.5,84
L76_GPS_TXD  (via drill 0.3)
  Top 0.3: v43.5,85 43.5,87.5 45,89 49.7,89 51,90.3 JMP1.3
  Bottom 0.3: U2.2 43.7,84.8 v43.5,85
LORA_!CS
  Top 0.3: J3.51 67.2,93.2 65,91 65,72 64,71 64,70 58.5,64.5 58.5,61.5 58,61 53,61 52.19,61.81 J2.24
LORA_GPS_RXD  (via drill 0.3)
  Top 0.3: J3.33 69,86 68.5,86.5 68.5,87.5 v68,88 | v55.5,95.5 55.2,95.2 JMP2.1
  Bottom 0.3: v55.5,95.5 56,96 60,96 v68,88
LORA_GPS_TXD  (via drill 0.3)
  Top 0.3: J3.31 68.8,85.2 68,86 68,87 v67.5,87.5 | v49.5,95.5 49.8,95.2 JMP1.1
  Bottom 0.3: v49.5,95.5 50.5,94.5 55.5,94.5 56.5,95.5 59.5,95.5 v67.5,87.5
LORA_RESET  (via drill 0.3)
  Top 0.3: J3.22 63.6,81.6 v64,82 | R6.2 v66,54.5 R7.2
  Bottom 0.3: v64,82 64.47,82.47 67.53,82.47 70,80 70,63 66,59 v66,54.5
N$1  (via drill 0.3)
  Top 0.3: J2.16 62.35,64.85 v62.5,65 | R7.1 63.15,55.65 63.5,56 63.5,58.5 66,61 v66,65
  Bottom 0.3: v62.5,65 v66,65
N$2
  Top 0.5: C3.2 82.75,78.35 U1.4
N$3
  Top 0.3: R6.1 68.85,55.65 67.43,57.07 J2.11
N$4
  Bottom 0.3: L2.2 25.5,81.85 R15.1
N$5
  Top 0.5: U1.1 87.06,77.85 C6.1
N$6
  Top 0.5: U1.5 82.94,73.15 R13.2 79.5,71.65 R12.1 C10.1
N$7
  Top 0.3: LED4.C 75.5,72.85 R14.2
N$8
  Bottom 0.3: D3.C 50.1,81.75 R8.2
N$9
  Top 0.3: Q1.1 71.5,41.05 R5.1
N$10
  Bottom 0.3: U2.14 33.5,81.5 33,82 R15.2
N$11
  Top 0.5: C5.2 R9.1
N$12
  Top 0.5: U1.6 84.36,71.72 R9.2 C7.2
N$13
  Top 0.3: J2.1 80.13,53.63 79,52.5 77.65,52.5 R11.2 R10.2
N$14
  Top 0.5: FAN-.1 69,37.1 D2.A 70.5,38.6 Q1.3
N$15
  Top 1.2: J1.2 82.89,91.79 F1.1
N$16
  Bottom 0.3: U2.16 32.8,83.7 TP1.TP
N$17
  Bottom 0.3: U2.17 33.7,84.8 TP2.TP
N$18
  Bottom 0.3: U2.18 35.65,86.85 34,88.5 TP3.TP
N$19
  Top 0.3: J3.25 72.2,82.8 74,81 R17.2
N$20
  Top 0.3: R2.1 93.9,41.15 LED1.C
N$21
  Top 0.3: R3.1 93.9,47.15 LED2.C
N$22
  Top 0.3: R4.1 93.9,53.15 LED3.C
N$23  (via drill 0.3)
  Top 0.3: LED1.A 94,43.5 v95.5,45 | v72.5,55.5 J2.7
  Bottom 0.3: v95.5,45 96,45.5 96,56 94,58 91,58 89.5,56.5 73.5,56.5 v72.5,55.5
N$24  (via drill 0.3)
  Top 0.3: LED2.A 94,49.5 v93,50.5 | v44.5,55 44.5,57.33 J2.29
  Bottom 0.3: v93,50.5 66,50.5 61.5,55 v44.5,55
N$25  (via drill 0.3)
  Top 0.3: LED3.A 94,55.5 v93,56.5 | v42,55.5 42,57.37 J2.31
  Bottom 0.3: v42,55.5 43.5,57 60.5,57 66.5,51 91.5,51 93,52.5 v93,56.5
RF_CON
  Bottom 0.5: L2.1 25.5,78 | 27.65,78 C19.2 27.5,78
  Bottom 0.7: J4.1 25.5,78 27.5,78 | R16.1 27.65,78
RF_MATCHED
  Bottom 0.5: U2.11 35.6,78.15 | C14.2 32.35,78
  Bottom 0.7: 35.6,78.15 C14.2 | 32.35,78 R16.2
SP_MOSI  (via drill 0.3)
  Top 0.3: J3.49 68.1,92.4 v68,92.5 | J2.19 57.27,58.77 58,59.5 62.5,59.5 64,61 64,67 64.5,67.5 67,67.5 68,68.5 68,70 66.5,71.5 66.5,88.5 v68,90
  Bottom 0.3: v68,90 v68,92.5
SPI_CLK
  Top 0.3: J3.45 66.8,90.8 65.5,89.5 65.5,71.5 64.5,70.5 64.5,69.5 61,66 61,61.5 60,60.5 53,60.5 52.19,59.69 J2.23
SPI_MISO  (via drill 0.3)
  Top 0.3: J3.47 67.4,91.6 v67,92 | J2.21 54.73,59.23 55.5,60 62,60 63.5,61.5 63.5,67.5 65,69 65,70 66,71 66,89 v67,90
  Bottom 0.3: v67,92 v67,90
SX1302_GPIO6  (via drill 0.3)
  Top 0.3: J2.26 49.65,64.15 v50,64.5 | J3.6 61,72 v60.5,72.5
  Bottom 0.3: v50,64.5 54.5,64.5 60.5,70.5 v60.5,72.5
VBAT
  Bottom 0.5: U2.6 46.55,80.4 R8.1 C4.1 47.97,83.68 B1.+
VIN
  Top 1: C2.1 86.6,81 C1.1
  Top 1.2: F1.2 88.11,86 86.6,84.48 C2.1 | D1.1 86.6,81
  pour Top (no thermals): 86,77.5 86,79 87.5,79 87.5,83.5 84.5,83.5 83.5,82.5 83,82 82.5,82 82.5,80 83,80 84,79 84,77.5

### Text on the board
tPlace: LORA GPS | L76 GPS | + | - | mPCIe LoRa Card / SPI only! | 8...40V | LoRa | GNSS | 5V ok | U2 | U1 | WAN | Tasmodul RasPi + LoRaWAN V1.0 | https://github.com/SebiR
bPlace: LoRa | L76 GPS | GNSS | Fan: GPIO17